# EAGLE schematic SIH26113_Maternity_Assist_Belt (EAGLE 9.6.2)

## Sheet 1 of 7: SHEET 1/7 - POWER ENTRY, CHARGING AND 3V3 REGULATION
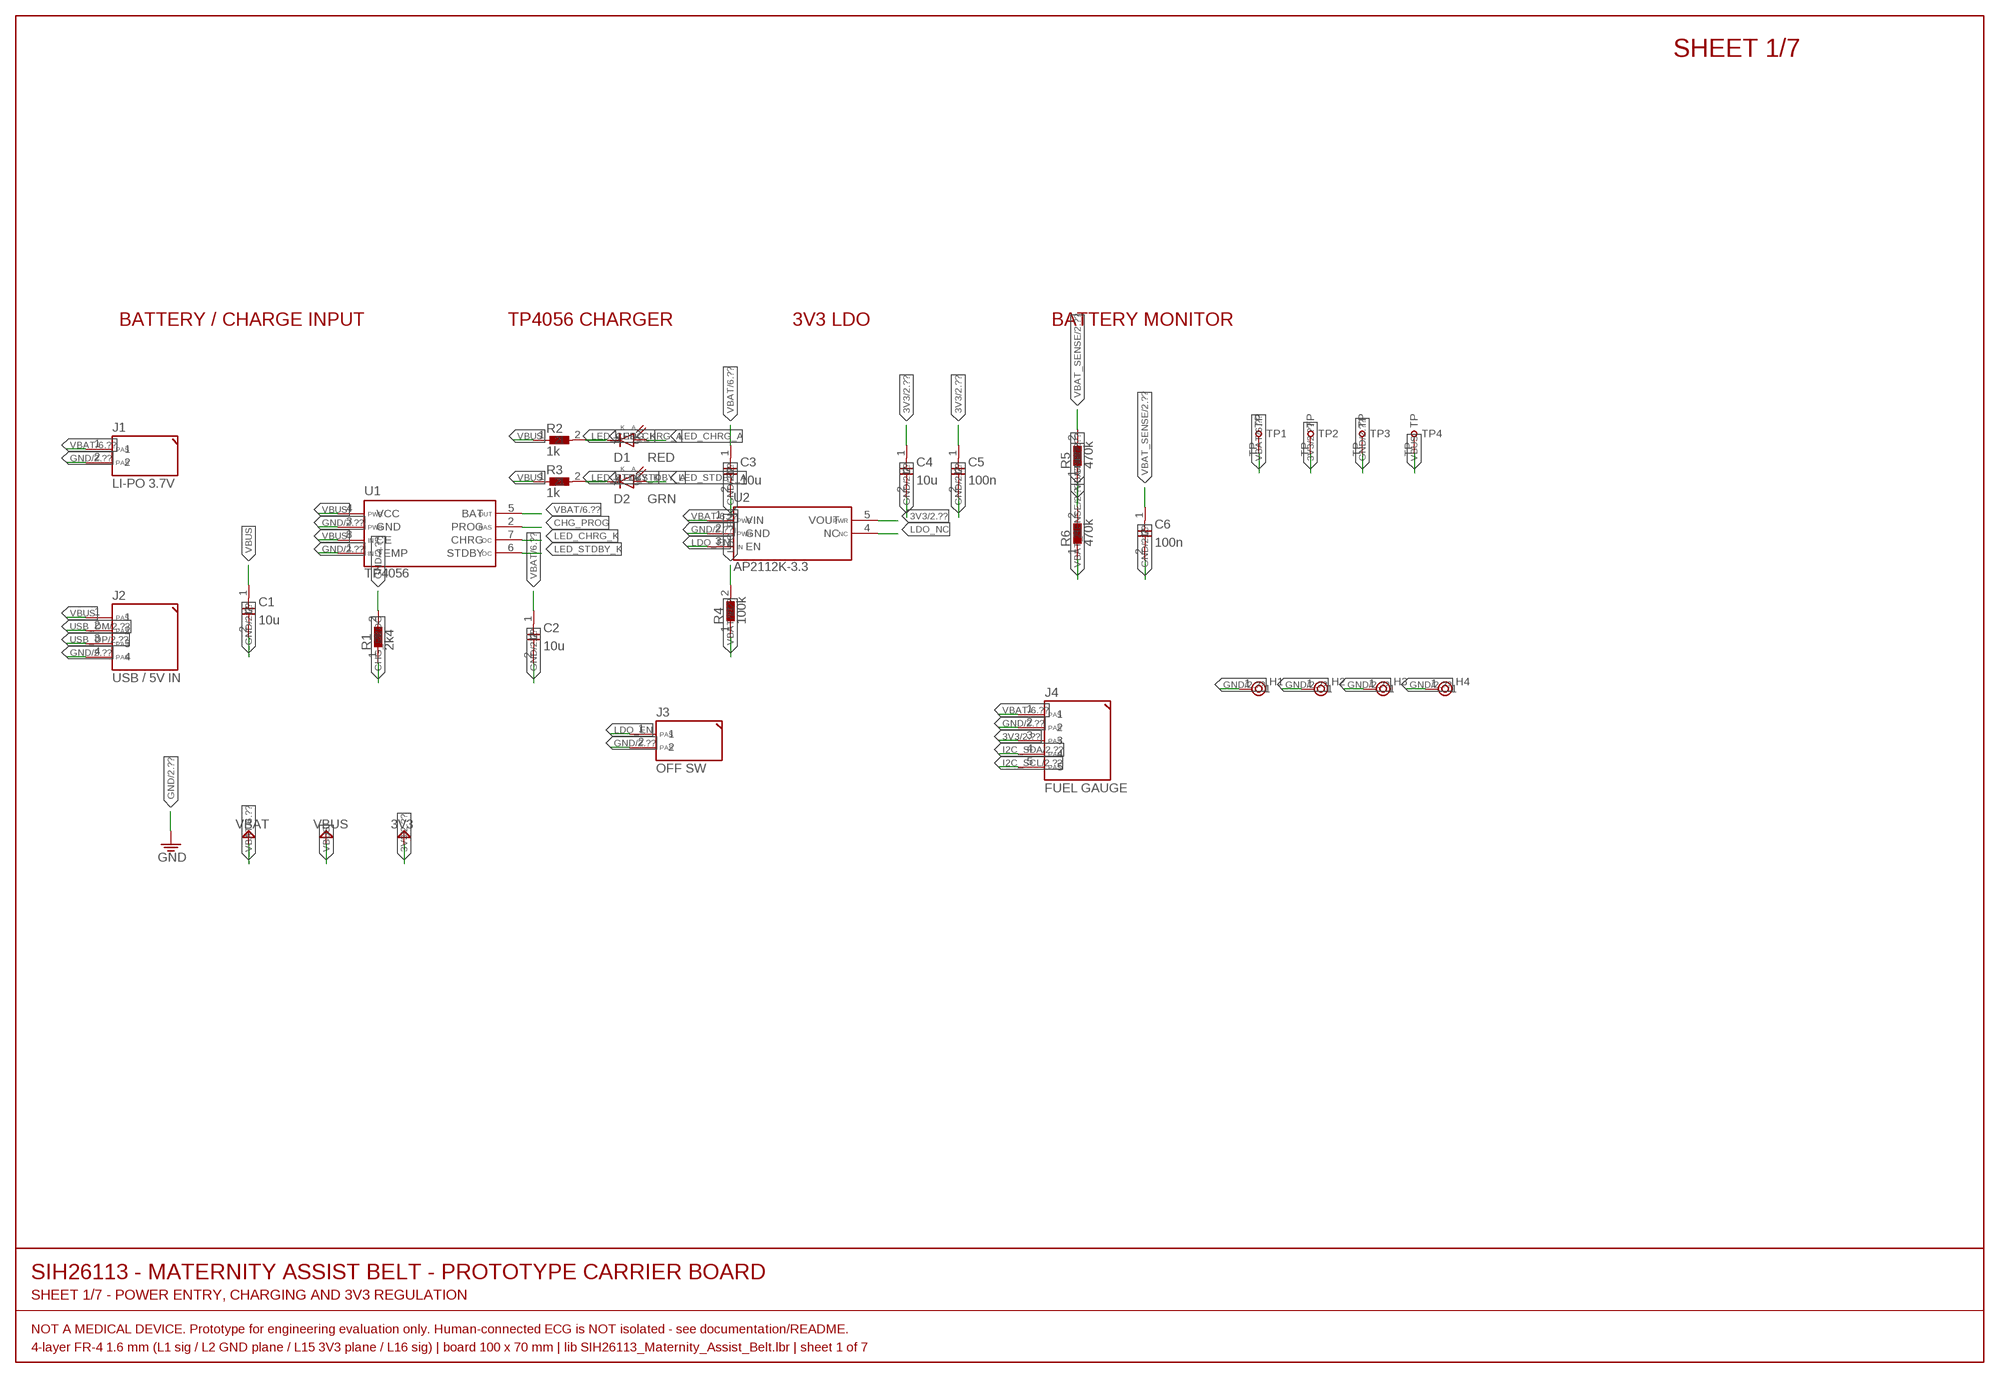
[diagram p0: schematic, sheet 1]

### Parts
C1  10u  C-0805  [C0805]
C2  10u  C-0805  [C0805]
C3  10u  C-0805  [C0805]
C4  10u  C-0805  [C0805]
C5  100n  C-0805  [C0805]
C6  100n  C-0805  [C0805]
D1  RED  LED-0805  [LED0805]
D2  GRN  LED-0805  [LED0805]
H1  M2  MOUNTHOLE-M2  [MOUNT-M2]
H2  M2  MOUNTHOLE-M2  [MOUNT-M2]
H3  M2  MOUNTHOLE-M2  [MOUNT-M2]
H4  M2  MOUNTHOLE-M2  [MOUNT-M2]
J1  LI-PO 3.7V  JST-PH-2  [JST-PH-2]
J2  USB / 5V IN  HDR-1X4  [HDR-1X4]
J3  OFF SW  HDR-1X2  [HDR-1X2]
J4  FUEL GAUGE  HDR-1X5  [HDR-1X5]
R1  2k4  R-0805  [R0805]
R2  1k  R-0805  [R0805]
R3  1k  R-0805  [R0805]
R4  100k  R-0805  [R0805]
R5  470k  R-0805  [R0805]
R6  470k  R-0805  [R0805]
TP1  VBAT  TESTPOINT  [TESTPOINT-1.5]
TP2  3V3  TESTPOINT  [TESTPOINT-1.5]
TP3  GND  TESTPOINT  [TESTPOINT-1.5]
TP4  VBUS  TESTPOINT  [TESTPOINT-1.5]
U1  TP4056  [SOIC-8-N]
U2  AP2112K-3.3  [SOT-23-5]

### Nets
3V3 [power]: C4.1 C5.1 J4.3 TP2.TP U2.5(VOUT) ; also sheet 2,3,4,5,6,7
CHG_PROG: R1.1 U1.2(PROG)
GND [power]: C1.2 C2.2 C3.2 C4.2 C5.2 C6.2 H1.1 H2.1 H3.1 H4.1 J1.2 J2.4 J3.2 J4.2 R1.2 R6.2 TP3.TP U1.1(TEMP) U1.3(GND) U2.2(GND) ; also sheet 2,3,4,5,6,7
I2C_SCL: J4.5 ; also sheet 2,3,7
I2C_SDA: J4.4 ; also sheet 2,3,7
LDO_EN: J3.1 R4.2 U2.3(EN)
LDO_NC: U2.4(NC)
LED_CHRG_A: D1.2(A) R2.2
LED_CHRG_K: D1.1(C) U1.7(CHRG)
LED_STDBY_A: D2.2(A) R3.2
LED_STDBY_K: D2.1(C) U1.6(STDBY)
USB_DM: J2.2 ; also sheet 2
USB_DP: J2.3 ; also sheet 2
VBAT [power]: C2.1 C3.1 J1.1 J4.1 R4.1 R5.1 TP1.TP U1.5(BAT) U2.1(VIN) ; also sheet 6
VBAT_SENSE: C6.1 R5.2 R6.1 ; also sheet 2
VBUS [power]: C1.1 J2.1 R2.1 R3.1 TP4.TP U1.4(VCC) U1.8(CE)

### Notes on the sheet
- SHEET 1/7
- BATTERY / CHARGE INPUT | TP4056 CHARGER | 3V3 LDO | BATTERY MONITOR
- SIH26113 - MATERNITY ASSIST BELT - PROTOTYPE CARRIER BOARD
- SHEET 1/7 - POWER ENTRY, CHARGING AND 3V3 REGULATION
- NOT A MEDICAL DEVICE. Prototype for engineering evaluation only. Human-connected ECG is NOT isolated - see documentation/README.
- 4-layer FR-4 1.6 mm (L1 sig / L2 GND plane / L15 3V3 plane / L16 sig) | board 100 x 70 mm | lib SIH26113_Maternity_Assist_Belt.lbr | sheet 1 of 7

## Sheet 2 of 7: SHEET 2/7 - ESP32-S3 CENTRAL MCU, RESET/BOOT, PROGRAMMING, INDICATORS
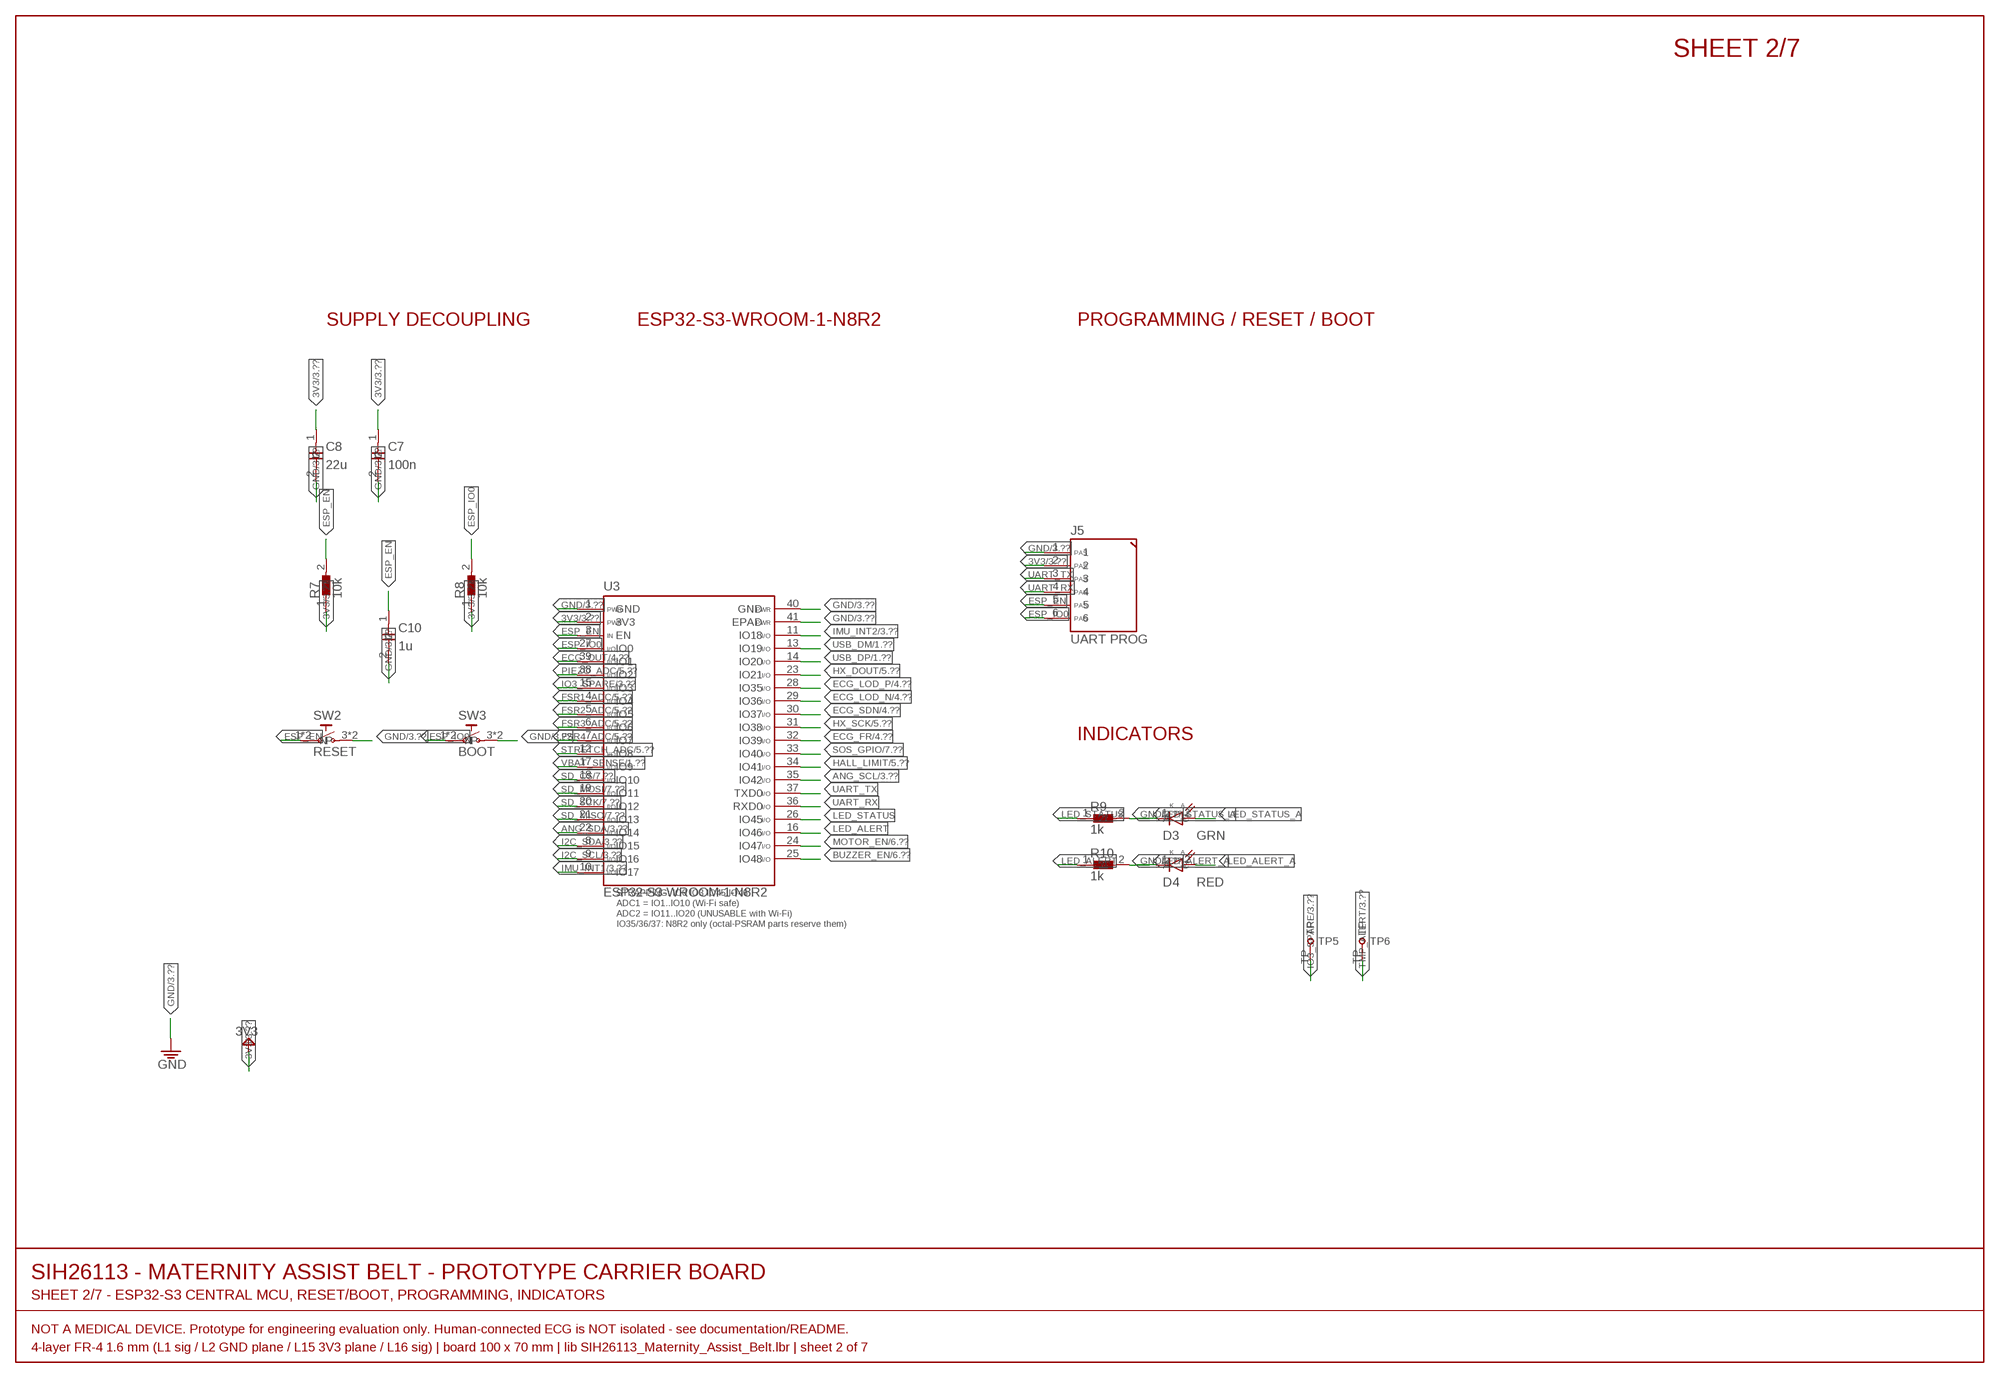
[diagram p1: schematic, sheet 2]

### Parts
C7  100n  C-0805  [C0805]
C8  22u  C-0805  [C0805]
C10  1u  C-0805  [C0805]
D3  GRN  LED-0805  [LED0805]
D4  RED  LED-0805  [LED0805]
J5  UART PROG  HDR-1X6  [HDR-1X6]
R7  10k  R-0805  [R0805]
R8  10k  R-0805  [R0805]
R9  1k  R-0805  [R0805]
R10  1k  R-0805  [R0805]
SW2  RESET  SW-TACT-6MM  [TACT-6X6-THT]
SW3  BOOT  SW-TACT-6MM  [TACT-6X6-THT]
TP5  IO3  TESTPOINT  [TESTPOINT-1.5]
TP6  TMP_ALERT  TESTPOINT  [TESTPOINT-1.5]
U3  ESP32-S3-WROOM-1-N8R2  ESP32-S3-WROOM-1  [ESP32-S3-WROOM-1]

### Nets
3V3 [power]: C7.1 C8.1 J5.2 R7.1 R8.1 U3.2(3V3) ; also sheet 1,3,4,5,6,7
ANG_SCL: U3.35(IO42) ; also sheet 3
ANG_SDA: U3.22(IO14) ; also sheet 3
BUZZER_EN: U3.25(IO48) ; also sheet 6
ECG_FR: U3.32(IO39) ; also sheet 4
ECG_LOD_N: U3.29(IO36) ; also sheet 4
ECG_LOD_P: U3.28(IO35) ; also sheet 4
ECG_OUT [analog_ecg]: U3.39(IO1) ; also sheet 4
ECG_SDN: U3.30(IO37) ; also sheet 4
ESP_EN: C10.1 J5.5 R7.2 SW2.1(P) SW2.2(P) U3.3(EN)
ESP_IO0: J5.6 R8.2 SW3.1(P) SW3.2(P) U3.27(IO0)
FSR1_ADC: U3.4(IO4) ; also sheet 5
FSR2_ADC: U3.5(IO5) ; also sheet 5
FSR3_ADC: U3.6(IO6) ; also sheet 5
FSR4_ADC: U3.7(IO7) ; also sheet 5
GND [power]: C7.2 C8.2 C10.2 D3.1(C) D4.1(C) J5.1 SW2.3(N) SW2.4(N) SW3.3(N) SW3.4(N) U3.1(GND) U3.40(GND) U3.41(EPAD) ; also sheet 1,3,4,5,6,7
HALL_LIMIT: U3.34(IO41) ; also sheet 5
HX_DOUT: U3.23(IO21) ; also sheet 5
HX_SCK: U3.31(IO38) ; also sheet 5
I2C_SCL: U3.9(IO16) ; also sheet 1,3,7
I2C_SDA: U3.8(IO15) ; also sheet 1,3,7
IMU_INT1: U3.10(IO17) ; also sheet 3
IMU_INT2: U3.11(IO18) ; also sheet 3
IO3_SPARE: TP5.TP U3.15(IO3) ; also sheet 3
LED_ALERT: R10.1 U3.16(IO46)
LED_ALERT_A: D4.2(A) R10.2
LED_STATUS: R9.1 U3.26(IO45)
LED_STATUS_A: D3.2(A) R9.2
MOTOR_EN: U3.24(IO47) ; also sheet 6
PIEZO_ADC: U3.38(IO2) ; also sheet 5
SD_CS: U3.18(IO10) ; also sheet 7
SD_MISO: U3.21(IO13) ; also sheet 7
SD_MOSI: U3.19(IO11) ; also sheet 7
SD_SCK: U3.20(IO12) ; also sheet 7
SOS_GPIO: U3.33(IO40) ; also sheet 7
STRETCH_ADC: U3.12(IO8) ; also sheet 5
TMP_ALERT: TP6.TP ; also sheet 3
UART_RX: J5.4 U3.36(RXD0)
UART_TX: J5.3 U3.37(TXD0)
USB_DM: U3.13(IO19) ; also sheet 1
USB_DP: U3.14(IO20) ; also sheet 1
VBAT_SENSE: U3.17(IO9) ; also sheet 1

### Notes on the sheet
- SHEET 2/7
- SUPPLY DECOUPLING | ESP32-S3-WROOM-1-N8R2 | PROGRAMMING / RESET / BOOT
- INDICATORS
- SIH26113 - MATERNITY ASSIST BELT - PROTOTYPE CARRIER BOARD
- SHEET 2/7 - ESP32-S3 CENTRAL MCU, RESET/BOOT, PROGRAMMING, INDICATORS
- NOT A MEDICAL DEVICE. Prototype for engineering evaluation only. Human-connected ECG is NOT isolated - see documentation/README.
- 4-layer FR-4 1.6 mm (L1 sig / L2 GND plane / L15 3V3 plane / L16 sig) | board 100 x 70 mm | lib SIH26113_Maternity_Assist_Belt.lbr | sheet 2 of 7

## Sheet 3 of 7: SHEET 3/7 - I2C SENSORS (TMP117, LSM6DSOX, AS5600) - TWO BUSSES
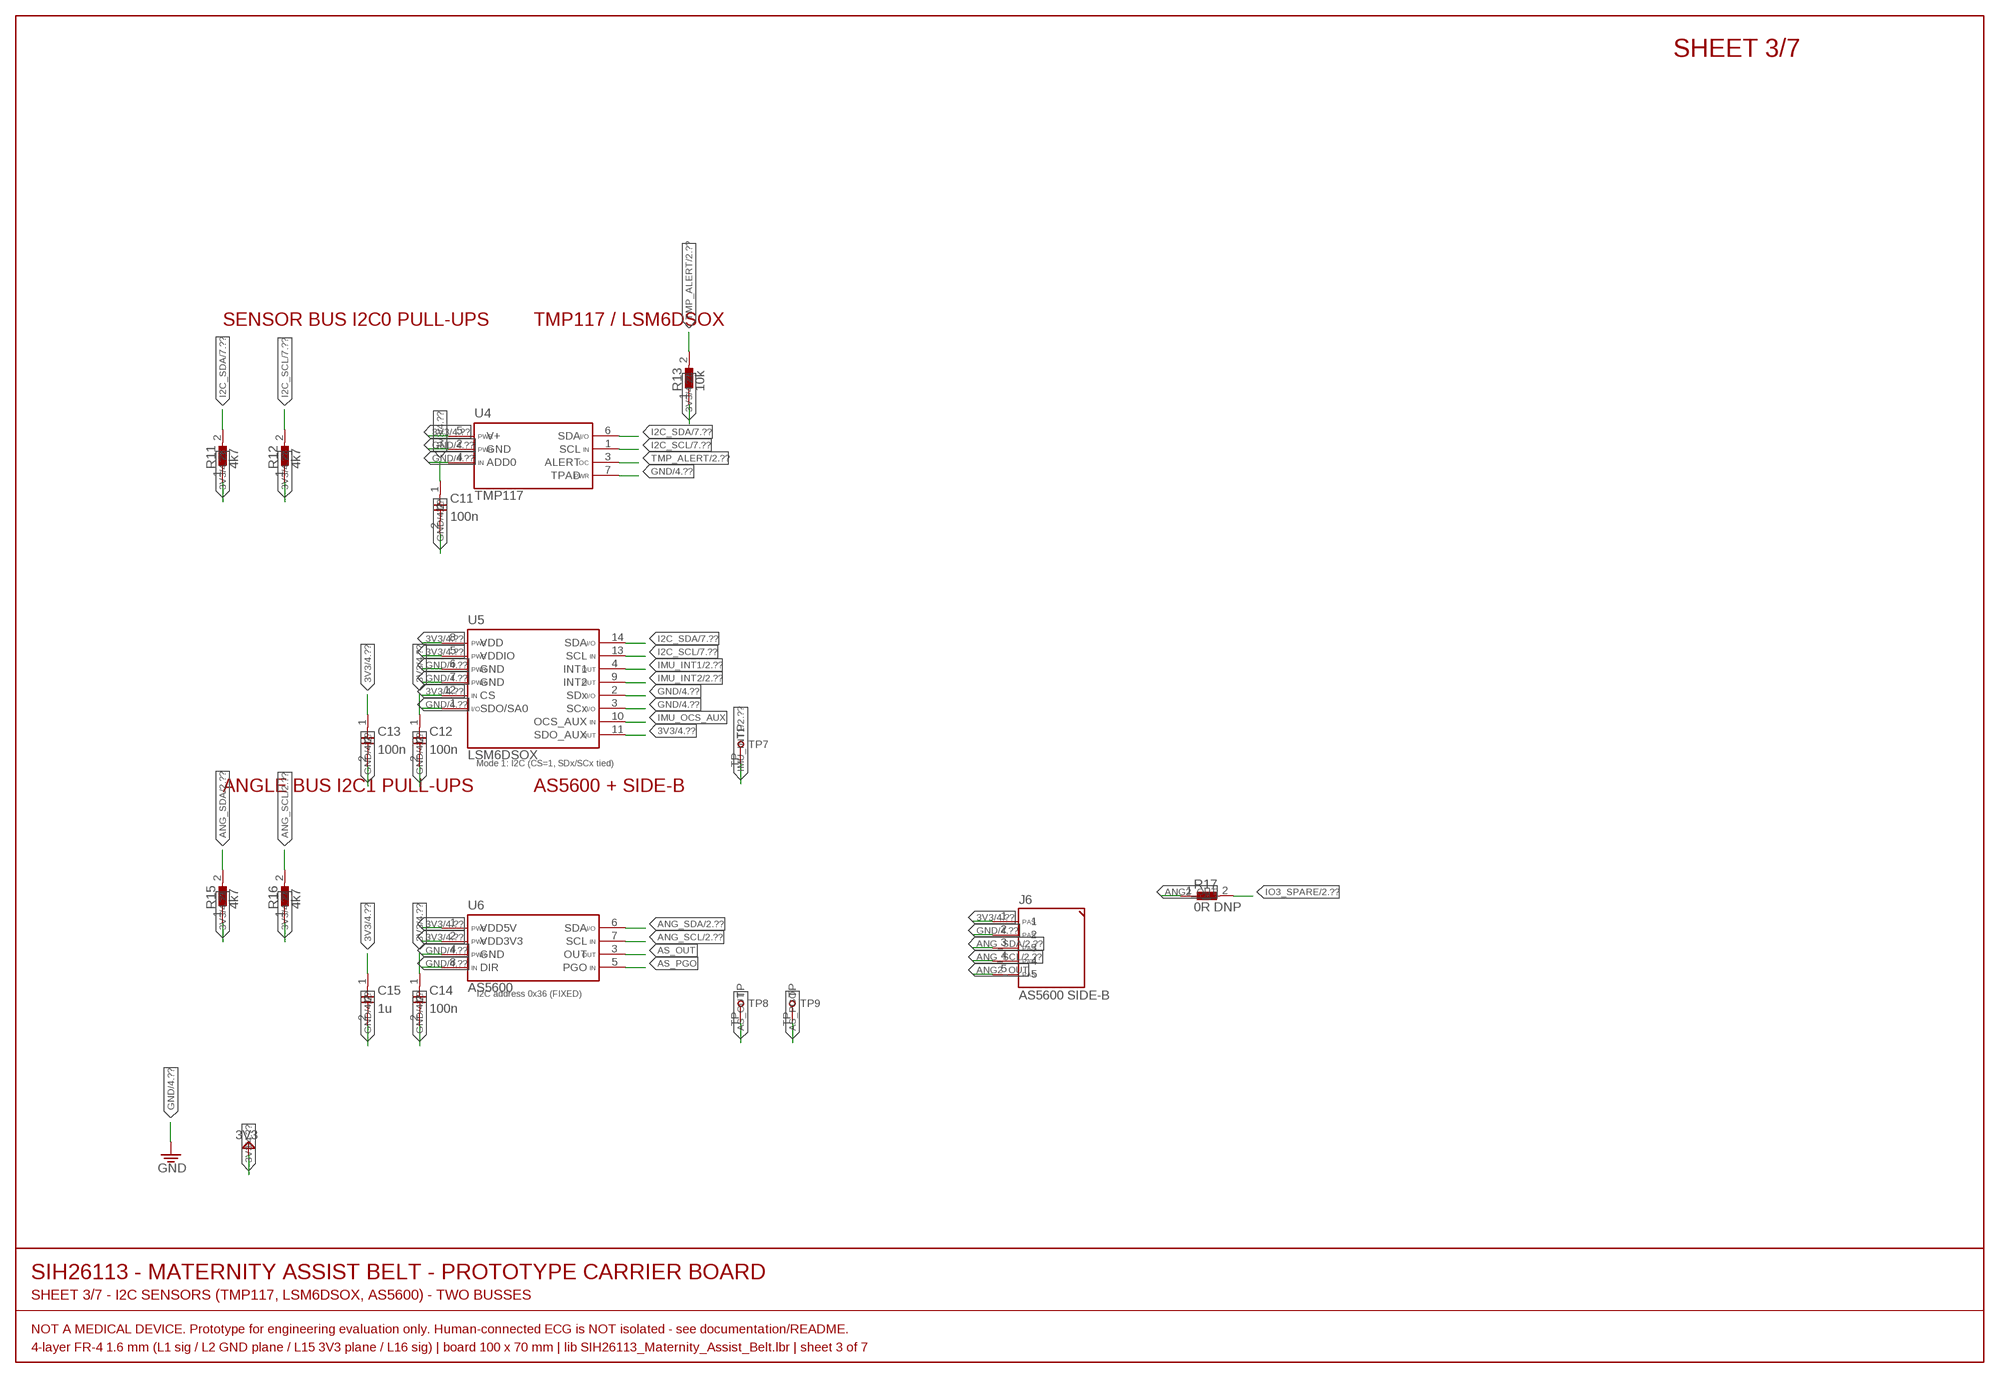
[diagram p2: schematic, sheet 3]

### Parts
C11  100n  C-0805  [C0805]
C12  100n  C-0805  [C0805]
C13  100n  C-0805  [C0805]
C14  100n  C-0805  [C0805]
C15  1u  C-0805  [C0805]
J6  AS5600 SIDE-B  HDR-1X5  [HDR-1X5]
R11  4k7  R-0805  [R0805]
R12  4k7  R-0805  [R0805]
R13  10k  R-0805  [R0805]
R15  4k7  R-0805  [R0805]
R16  4k7  R-0805  [R0805]
R17  0R DNP  R-0805  [R0805]
TP7  IMU_INT1  TESTPOINT  [TESTPOINT-1.5]
TP8  AS_OUT  TESTPOINT  [TESTPOINT-1.5]
TP9  AS_PGO  TESTPOINT  [TESTPOINT-1.5]
U4  TMP117  [WSON-6-DRV0006B]
U5  LSM6DSOX  [LGA-14L-2.5X3.0]
U6  AS5600  [SOIC-8-N]

### Nets
3V3 [power]: C11.1 C12.1 C13.1 C14.1 C15.1 J6.1 R11.1 R12.1 R13.1 R15.1 R16.1 U4.5(V+) U5.5(VDDIO) U5.8(VDD) U5.11(SDO_AUX) U5.12(CS) U6.1(VDD5V) U6.2(VDD3V3) ; also sheet 1,2,4,5,6,7
ANG2_OUT: J6.5 R17.1
ANG_SCL: J6.4 R16.2 U6.7(SCL) ; also sheet 2
ANG_SDA: J6.3 R15.2 U6.6(SDA) ; also sheet 2
AS_OUT: TP8.TP U6.3(OUT)
AS_PGO: TP9.TP U6.5(PGO)
GND [power]: C11.2 C12.2 C13.2 C14.2 C15.2 J6.2 U4.2(GND) U4.4(ADD0) U4.7(TPAD) U5.1(SDO/SA0) U5.2(SDx) U5.3(SCx) U5.6(GND) U5.7(GND) U6.4(GND) U6.8(DIR) ; also sheet 1,2,4,5,6,7
I2C_SCL: R12.2 U4.1(SCL) U5.13(SCL) ; also sheet 1,2,7
I2C_SDA: R11.2 U4.6(SDA) U5.14(SDA) ; also sheet 1,2,7
IMU_INT1: TP7.TP U5.4(INT1) ; also sheet 2
IMU_INT2: U5.9(INT2) ; also sheet 2
IMU_OCS_AUX: U5.10(OCS_AUX)
IO3_SPARE: R17.2 ; also sheet 2
TMP_ALERT: R13.2 U4.3(ALERT) ; also sheet 2

### Notes on the sheet
- SHEET 3/7
- SENSOR BUS I2C0 PULL-UPS | TMP117 / LSM6DSOX
- ANGLE BUS I2C1 PULL-UPS | AS5600 + SIDE-B
- SIH26113 - MATERNITY ASSIST BELT - PROTOTYPE CARRIER BOARD
- SHEET 3/7 - I2C SENSORS (TMP117, LSM6DSOX, AS5600) - TWO BUSSES
- NOT A MEDICAL DEVICE. Prototype for engineering evaluation only. Human-connected ECG is NOT isolated - see documentation/README.
- 4-layer FR-4 1.6 mm (L1 sig / L2 GND plane / L15 3V3 plane / L16 sig) | board 100 x 70 mm | lib SIH26113_Maternity_Assist_Belt.lbr | sheet 3 of 7

## Sheet 4 of 7: SHEET 4/7 - ECG ANALOG FRONT END (AD8232)
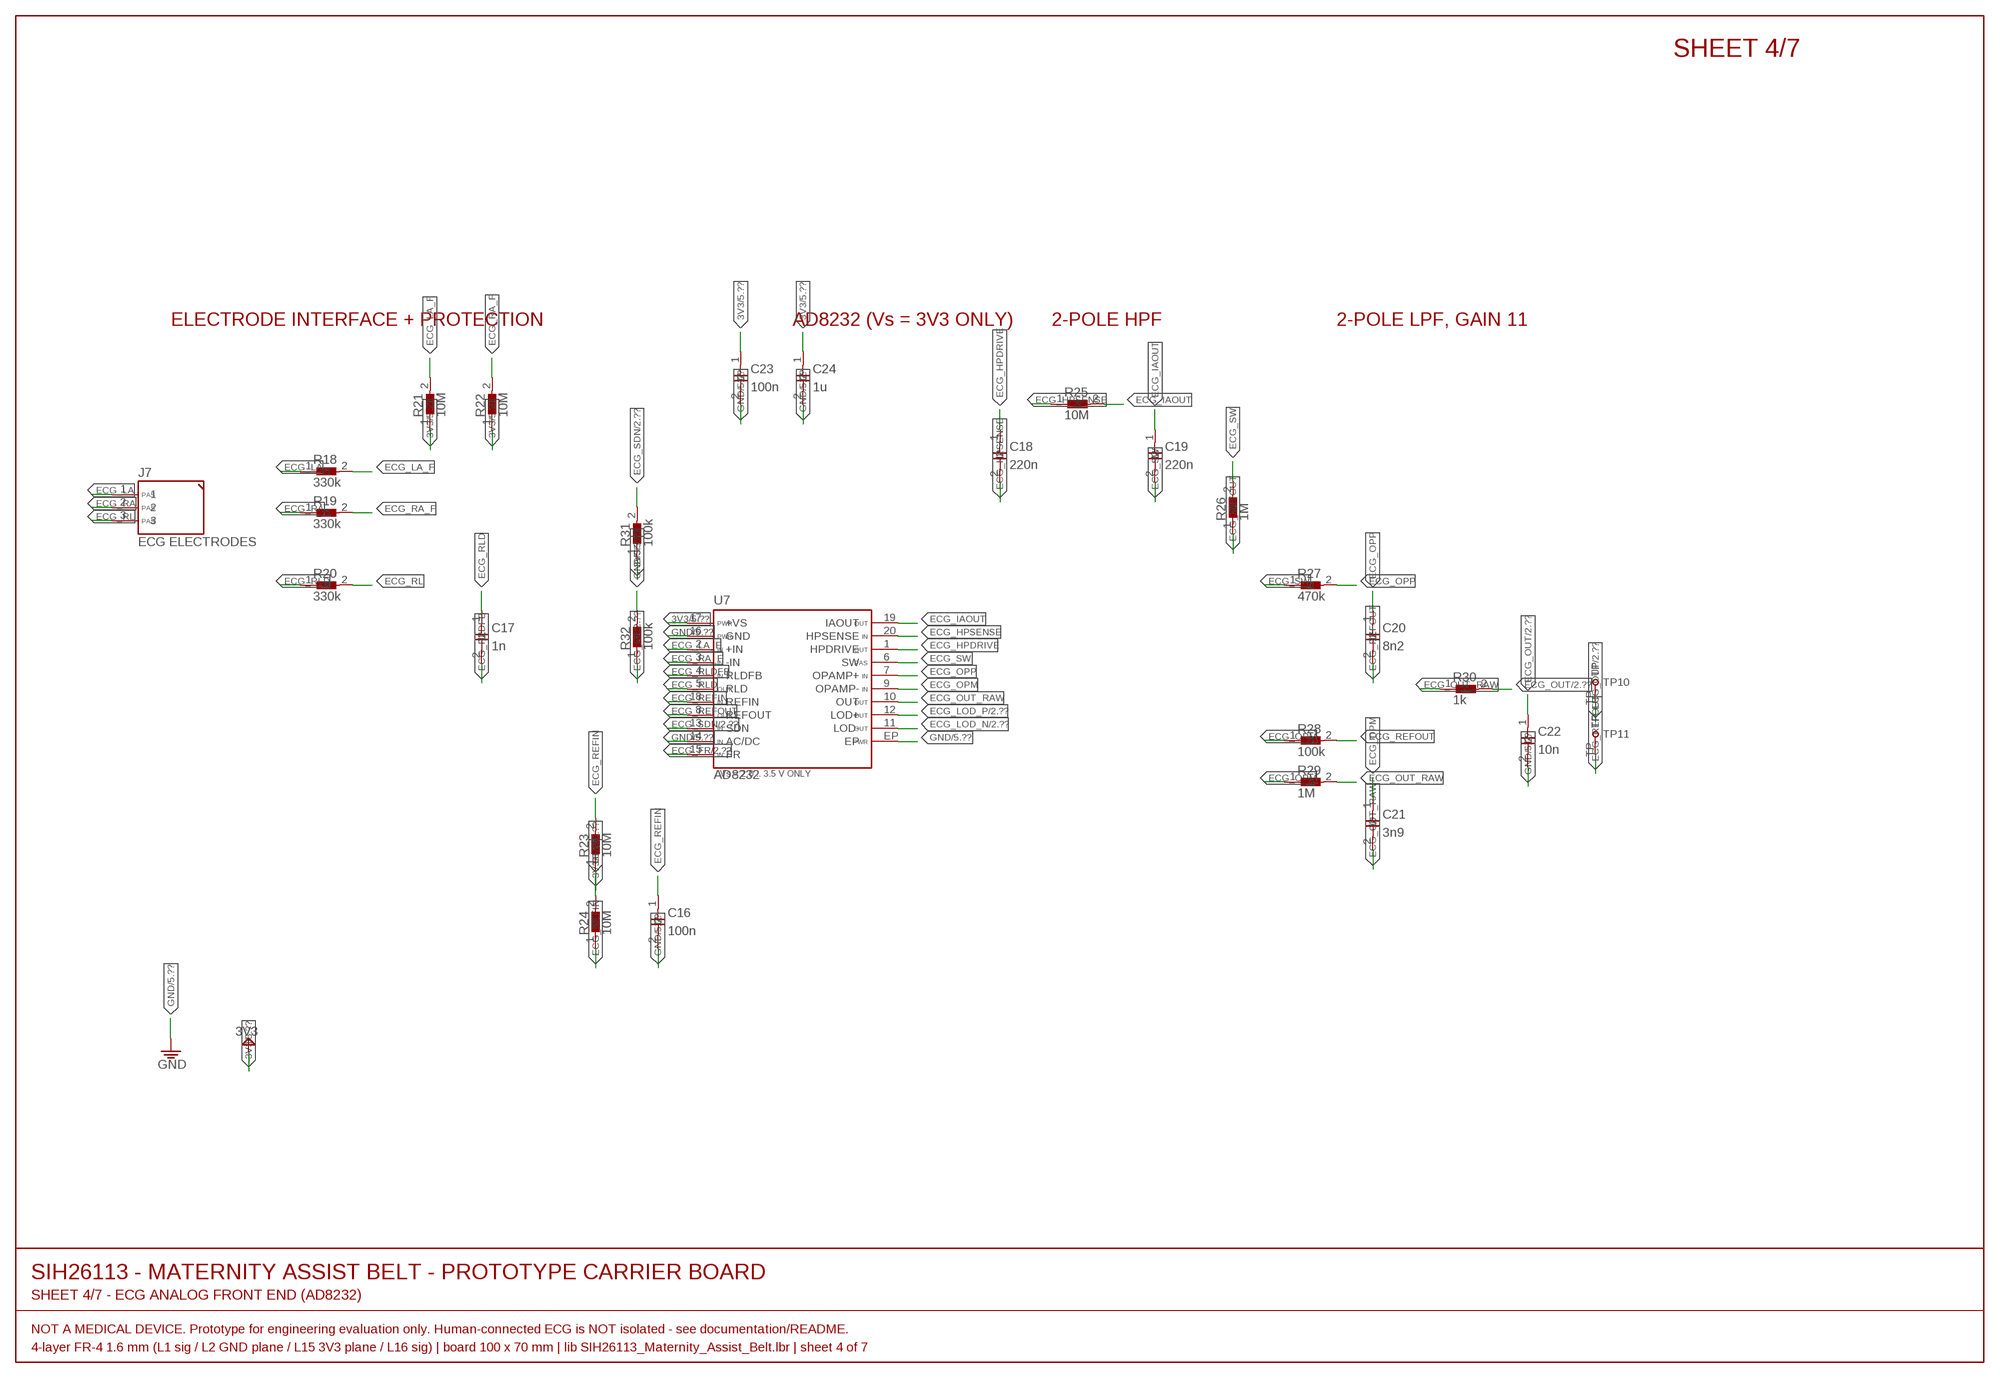
[diagram p3: schematic, sheet 4]

### Parts
C16  100n  C-0805  [C0805]
C17  1n  C-0805  [C0805]
C18  220n  C-0805  [C0805]
C19  220n  C-0805  [C0805]
C20  8n2  C-0805  [C0805]
C21  3n9  C-0805  [C0805]
C22  10n  C-0805  [C0805]
C23  100n  C-0805  [C0805]
C24  1u  C-0805  [C0805]
J7  ECG ELECTRODES  HDR-1X3  [HDR-1X3]
R18  330k  R-0805  [R0805]
R19  330k  R-0805  [R0805]
R20  330k  R-0805  [R0805]
R21  10M  R-0805  [R0805]
R22  10M  R-0805  [R0805]
R23  10M  R-0805  [R0805]
R24  10M  R-0805  [R0805]
R25  10M  R-0805  [R0805]
R26  1M  R-0805  [R0805]
R27  470k  R-0805  [R0805]
R28  100k  R-0805  [R0805]
R29  1M  R-0805  [R0805]
R30  1k  R-0805  [R0805]
R31  100k  R-0805  [R0805]
R32  100k  R-0805  [R0805]
TP10  ECG_OUT  TESTPOINT  [TESTPOINT-1.5]
TP11  ECG_REF  TESTPOINT  [TESTPOINT-1.5]
U7  AD8232  [LFCSP-20-4X4-P050]

### Nets
3V3 [power]: C23.1 C24.1 R21.1 R22.1 R23.1 R31.1 U7.17(+VS) ; also sheet 1,2,3,5,6,7
ECG_FR: R32.1 U7.15(FR) ; also sheet 2
ECG_HPDRIVE: C18.1 U7.1(HPDRIVE)
ECG_HPSENSE [analog_ecg]: C18.2 R25.1 U7.20(HPSENSE)
ECG_IAOUT [analog_ecg]: C19.1 R25.2 U7.19(IAOUT)
ECG_LA [analog_ecg]: J7.1 R18.1
ECG_LA_F [analog_ecg]: R18.2 R21.2 U7.2(+IN)
ECG_LOD_N: U7.11(LOD-) ; also sheet 2
ECG_LOD_P: U7.12(LOD+) ; also sheet 2
ECG_OPM [analog_ecg]: C21.1 R28.1 R29.1 U7.9(OPAMP-)
ECG_OPP [analog_ecg]: C20.1 R27.2 U7.7(OPAMP+)
ECG_OUT [analog_ecg]: C22.1 R30.2 TP10.TP ; also sheet 2
ECG_OUT_RAW [analog_ecg]: C21.2 R29.2 R30.1 U7.10(OUT)
ECG_RA [analog_ecg]: J7.2 R19.1
ECG_RA_F [analog_ecg]: R19.2 R22.2 U7.3(-IN)
ECG_REFIN [analog_ecg]: C16.1 R23.2 R24.1 U7.18(REFIN)
ECG_REFOUT [analog_ecg]: C20.2 R26.1 R28.2 TP11.TP U7.8(REFOUT)
ECG_RL [analog_ecg]: J7.3 R20.2
ECG_RLD [analog_ecg]: C17.1 R20.1 U7.5(RLD)
ECG_RLDFB: C17.2 U7.4(RLDFB)
ECG_SDN: R31.2 U7.13(SDN) ; also sheet 2
ECG_SW [analog_ecg]: C19.2 R26.2 R27.1 U7.6(SW)
GND [power]: C16.2 C22.2 C23.2 C24.2 R24.2 R32.2 U7.14(AC/DC) U7.16(GND) U7.EP ; also sheet 1,2,3,5,6,7

### Notes on the sheet
- SHEET 4/7
- ELECTRODE INTERFACE + PROTECTION | AD8232 (Vs = 3V3 ONLY) | 2-POLE HPF | 2-POLE LPF, GAIN 11
- SIH26113 - MATERNITY ASSIST BELT - PROTOTYPE CARRIER BOARD
- SHEET 4/7 - ECG ANALOG FRONT END (AD8232)
- NOT A MEDICAL DEVICE. Prototype for engineering evaluation only. Human-connected ECG is NOT isolated - see documentation/README.
- 4-layer FR-4 1.6 mm (L1 sig / L2 GND plane / L15 3V3 plane / L16 sig) | board 100 x 70 mm | lib SIH26113_Maternity_Assist_Belt.lbr | sheet 4 of 7

## Sheet 5 of 7: SHEET 5/7 - MECHANICAL SENSING (LOAD CELL, FSR, STRETCH, PIEZO, HALL)
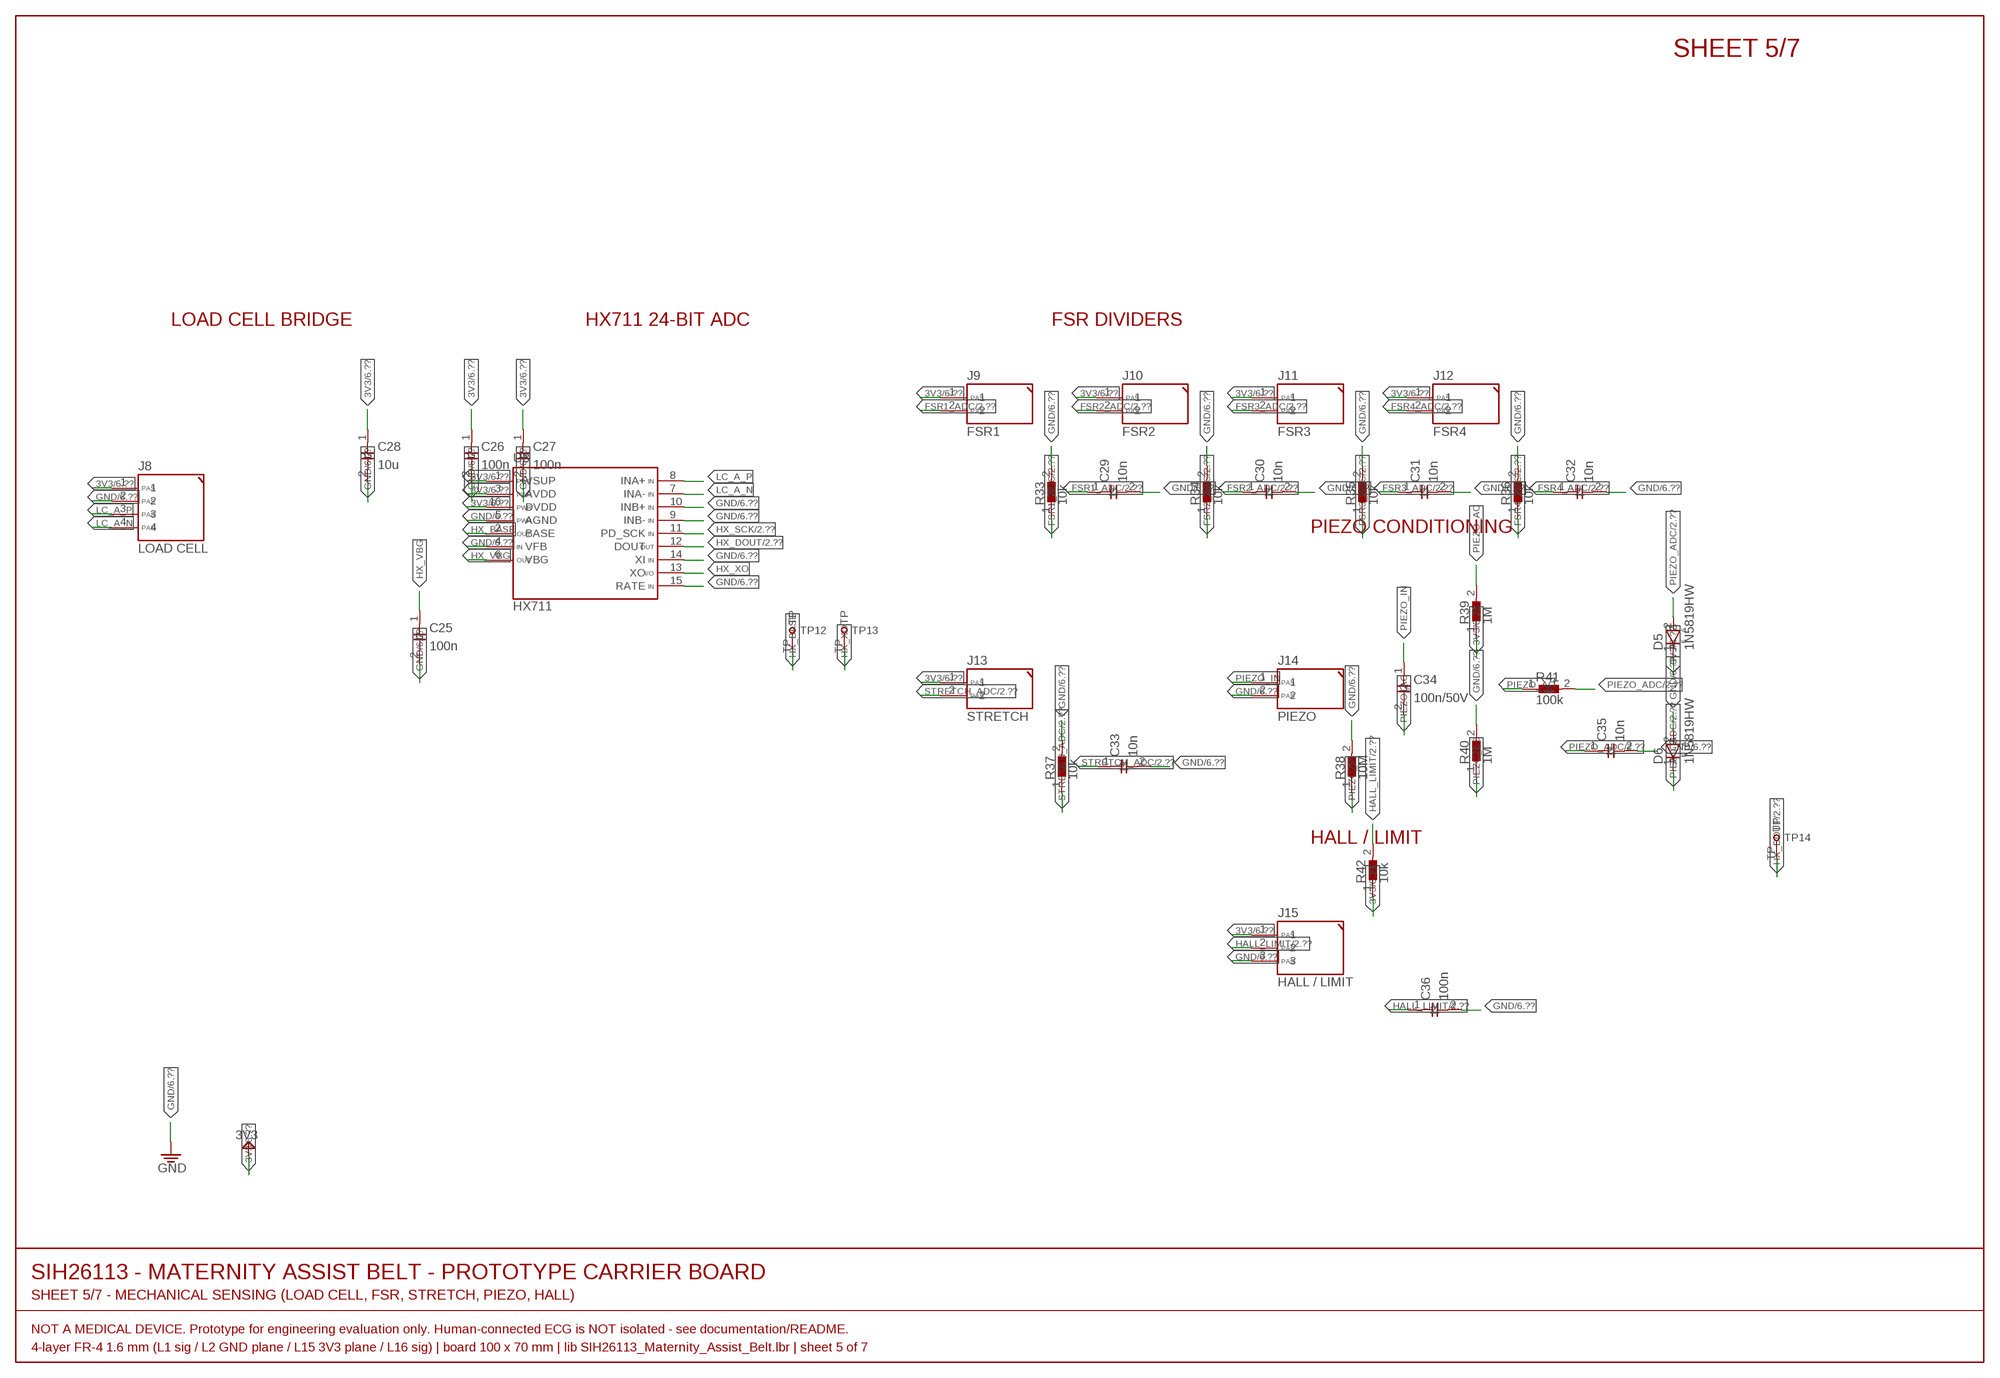
[diagram p4: schematic, sheet 5]

### Parts
C25  100n  C-0805  [C0805]
C26  100n  C-0805  [C0805]
C27  100n  C-0805  [C0805]
C28  10u  C-0805  [C0805]
C29  10n  C-0805  [C0805]
C30  10n  C-0805  [C0805]
C31  10n  C-0805  [C0805]
C32  10n  C-0805  [C0805]
C33  10n  C-0805  [C0805]
C34  100n/50V  C-0805  [C0805]
C35  10n  C-0805  [C0805]
C36  100n  C-0805  [C0805]
D5  1N5819HW  DIODE-SOD123  [SOD-123]
D6  1N5819HW  DIODE-SOD123  [SOD-123]
J8  LOAD CELL  JST-PH-4  [JST-PH-4]
J9  FSR1  HDR-1X2  [HDR-1X2]
J10  FSR2  HDR-1X2  [HDR-1X2]
J11  FSR3  HDR-1X2  [HDR-1X2]
J12  FSR4  HDR-1X2  [HDR-1X2]
J13  STRETCH  HDR-1X2  [HDR-1X2]
J14  PIEZO  HDR-1X2  [HDR-1X2]
J15  HALL / LIMIT  HDR-1X3  [HDR-1X3]
R33  10k  R-0805  [R0805]
R34  10k  R-0805  [R0805]
R35  10k  R-0805  [R0805]
R36  10k  R-0805  [R0805]
R37  10k  R-0805  [R0805]
R38  10M  R-0805  [R0805]
R39  1M  R-0805  [R0805]
R40  1M  R-0805  [R0805]
R41  100k  R-0805  [R0805]
R42  10k  R-0805  [R0805]
TP12  HX_BASE  TESTPOINT  [TESTPOINT-1.5]
TP13  HX_XO  TESTPOINT  [TESTPOINT-1.5]
TP14  HX_DOUT  TESTPOINT  [TESTPOINT-1.5]
U8  HX711  [SOP-16-N]

### Nets
3V3 [power]: C26.1 C27.1 C28.1 D5.1(C) J8.1 J9.1 J10.1 J11.1 J12.1 J13.1 J15.1 R39.1 R42.1 U8.1(VSUP) U8.3(AVDD) U8.16(DVDD) ; also sheet 1,2,3,4,6,7
FSR1_ADC: C29.1 J9.2 R33.1 ; also sheet 2
FSR2_ADC: C30.1 J10.2 R34.1 ; also sheet 2
FSR3_ADC: C31.1 J11.2 R35.1 ; also sheet 2
FSR4_ADC: C32.1 J12.2 R36.1 ; also sheet 2
GND [power]: C25.2 C26.2 C27.2 C28.2 C29.2 C30.2 C31.2 C32.2 C33.2 C35.2 C36.2 D6.2(A) J8.2 J14.2 J15.3 R33.2 R34.2 R35.2 R36.2 R37.2 R38.2 R40.2 U8.4(VFB) U8.5(AGND) U8.9(INB-) U8.10(INB+) U8.14(XI) U8.15(RATE) ; also sheet 1,2,3,4,6,7
HALL_LIMIT: C36.1 J15.2 R42.2 ; also sheet 2
HX_BASE: TP12.TP U8.2(BASE)
HX_DOUT: TP14.TP U8.12(DOUT) ; also sheet 2
HX_SCK: U8.11(PD_SCK) ; also sheet 2
HX_VBG: C25.1 U8.6(VBG)
HX_XO: TP13.TP U8.13(XO)
LC_A_N: J8.4 U8.7(INA-)
LC_A_P: J8.3 U8.8(INA+)
PIEZO_AC: C34.2 R39.2 R40.1 R41.1
PIEZO_ADC: C35.1 D5.2(A) D6.1(C) R41.2 ; also sheet 2
PIEZO_IN: C34.1 J14.1 R38.1
STRETCH_ADC: C33.1 J13.2 R37.1 ; also sheet 2

### Notes on the sheet
- SHEET 5/7
- LOAD CELL BRIDGE | HX711 24-BIT ADC | FSR DIVIDERS
- PIEZO CONDITIONING
- HALL / LIMIT
- SIH26113 - MATERNITY ASSIST BELT - PROTOTYPE CARRIER BOARD
- SHEET 5/7 - MECHANICAL SENSING (LOAD CELL, FSR, STRETCH, PIEZO, HALL)
- NOT A MEDICAL DEVICE. Prototype for engineering evaluation only. Human-connected ECG is NOT isolated - see documentation/README.
- 4-layer FR-4 1.6 mm (L1 sig / L2 GND plane / L15 3V3 plane / L16 sig) | board 100 x 70 mm | lib SIH26113_Maternity_Assist_Belt.lbr | sheet 5 of 7

## Sheet 6 of 7: SHEET 6/7 - FET-DRIVEN ALERTS (VIBRATION MOTOR, BUZZER)
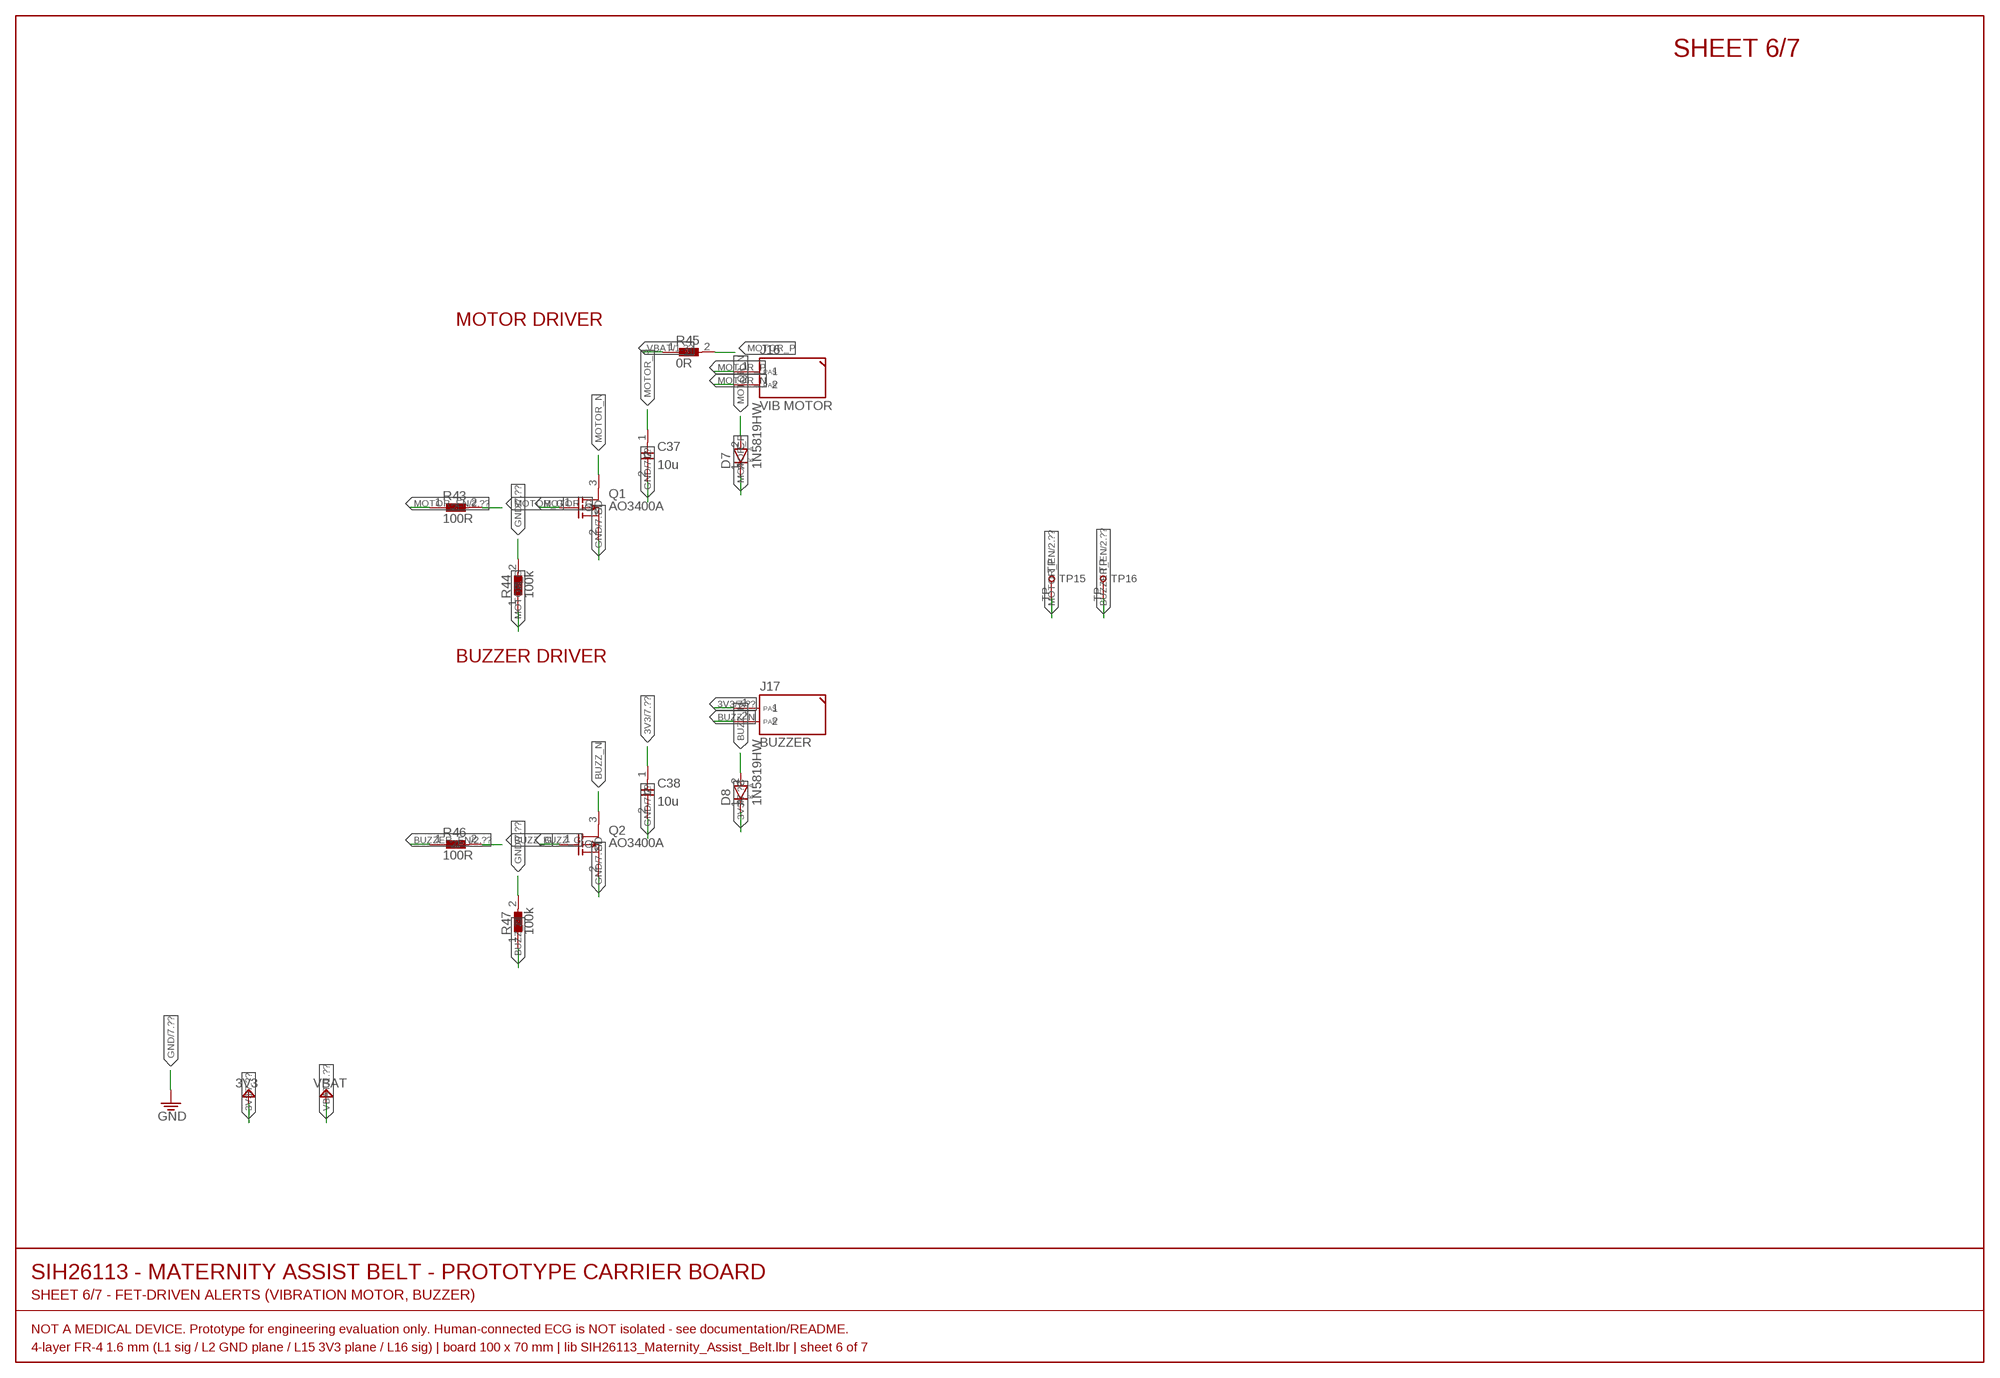
[diagram p5: schematic, sheet 6]

### Parts
C37  10u  C-0805  [C0805]
C38  10u  C-0805  [C0805]
D7  1N5819HW  DIODE-SOD123  [SOD-123]
D8  1N5819HW  DIODE-SOD123  [SOD-123]
J16  VIB MOTOR  HDR-1X2  [HDR-1X2]
J17  BUZZER  HDR-1X2  [HDR-1X2]
Q1  AO3400A  NMOS-SOT23  [SOT-23-3]
Q2  AO3400A  NMOS-SOT23  [SOT-23-3]
R43  100R  R-0805  [R0805]
R44  100k  R-0805  [R0805]
R45  0R  R-0805  [R0805]
R46  100R  R-0805  [R0805]
R47  100k  R-0805  [R0805]
TP15  MOTOR_EN  TESTPOINT  [TESTPOINT-1.5]
TP16  BUZZER_EN  TESTPOINT  [TESTPOINT-1.5]

### Nets
3V3 [power]: C38.1 D8.1(C) J17.1 ; also sheet 1,2,3,4,5,7
BUZZ_G: Q2.1(G) R46.2 R47.1
BUZZ_N: D8.2(A) J17.2 Q2.3(D)
BUZZER_EN: R46.1 TP16.TP ; also sheet 2
GND [power]: C37.2 C38.2 Q1.2(S) Q2.2(S) R44.2 R47.2 ; also sheet 1,2,3,4,5,7
MOTOR_EN: R43.1 TP15.TP ; also sheet 2
MOTOR_G: Q1.1(G) R43.2 R44.1
MOTOR_N [motor]: D7.2(A) J16.2 Q1.3(D)
MOTOR_P [motor]: C37.1 D7.1(C) J16.1 R45.2
VBAT [power]: R45.1 ; also sheet 1

### Notes on the sheet
- SHEET 6/7
- MOTOR DRIVER
- BUZZER DRIVER
- SIH26113 - MATERNITY ASSIST BELT - PROTOTYPE CARRIER BOARD
- SHEET 6/7 - FET-DRIVEN ALERTS (VIBRATION MOTOR, BUZZER)
- NOT A MEDICAL DEVICE. Prototype for engineering evaluation only. Human-connected ECG is NOT isolated - see documentation/README.
- 4-layer FR-4 1.6 mm (L1 sig / L2 GND plane / L15 3V3 plane / L16 sig) | board 100 x 70 mm | lib SIH26113_Maternity_Assist_Belt.lbr | sheet 6 of 7

## Sheet 7 of 7: SHEET 7/7 - USER INPUT AND STORAGE (SOS, microSD)
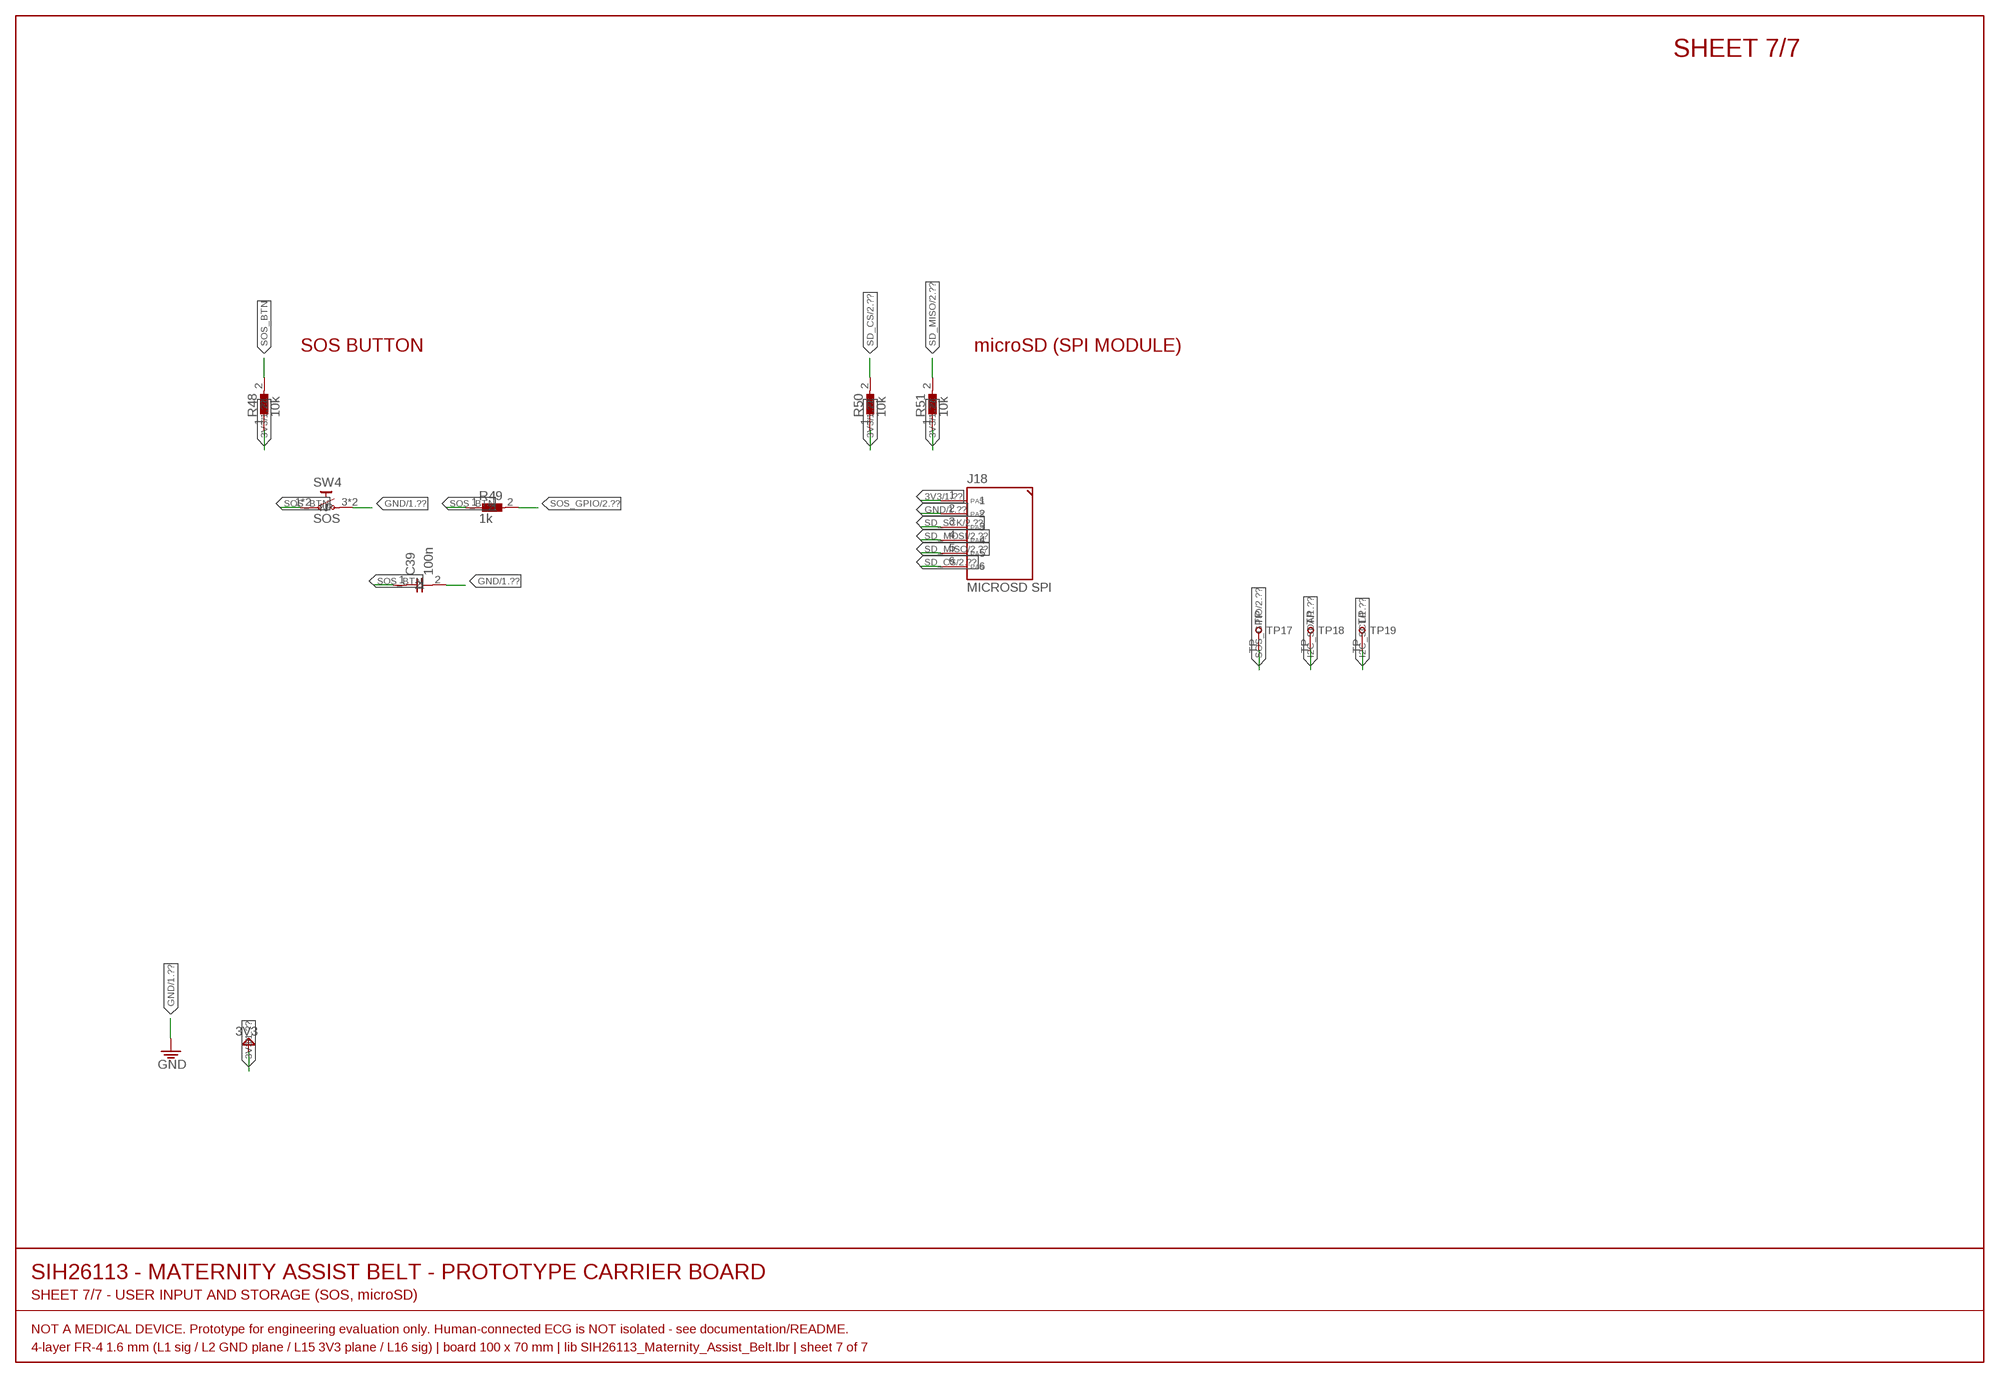
[diagram p6: schematic, sheet 7]

### Parts
C39  100n  C-0805  [C0805]
J18  MICROSD SPI  HDR-1X6  [HDR-1X6]
R48  10k  R-0805  [R0805]
R49  1k  R-0805  [R0805]
R50  10k  R-0805  [R0805]
R51  10k  R-0805  [R0805]
SW4  SOS  SW-TACT-6MM  [TACT-6X6-THT]
TP17  SOS_GPIO  TESTPOINT  [TESTPOINT-1.5]
TP18  I2C_SDA  TESTPOINT  [TESTPOINT-1.5]
TP19  I2C_SCL  TESTPOINT  [TESTPOINT-1.5]

### Nets
3V3 [power]: J18.1 R48.1 R50.1 R51.1 ; also sheet 1,2,3,4,5,6
GND [power]: C39.2 J18.2 SW4.3(N) SW4.4(N) ; also sheet 1,2,3,4,5,6
I2C_SCL: TP19.TP ; also sheet 1,2,3
I2C_SDA: TP18.TP ; also sheet 1,2,3
SD_CS: J18.6 R50.2 ; also sheet 2
SD_MISO: J18.5 R51.2 ; also sheet 2
SD_MOSI: J18.4 ; also sheet 2
SD_SCK: J18.3 ; also sheet 2
SOS_BTN: C39.1 R48.2 R49.1 SW4.1(P) SW4.2(P)
SOS_GPIO: R49.2 TP17.TP ; also sheet 2

### Notes on the sheet
- SHEET 7/7
- SOS BUTTON | microSD (SPI MODULE)
- SIH26113 - MATERNITY ASSIST BELT - PROTOTYPE CARRIER BOARD
- SHEET 7/7 - USER INPUT AND STORAGE (SOS, microSD)
- NOT A MEDICAL DEVICE. Prototype for engineering evaluation only. Human-connected ECG is NOT isolated - see documentation/README.
- 4-layer FR-4 1.6 mm (L1 sig / L2 GND plane / L15 3V3 plane / L16 sig) | board 100 x 70 mm | lib SIH26113_Maternity_Assist_Belt.lbr | sheet 7 of 7

## Library data of the parts
C1-C8 C10-C39 = SIH26113_Maternity_Assist_Belt:C-0805: Chip capacitor, 0805 (2012 metric)
D1-D4 = SIH26113_Maternity_Assist_Belt:LED-0805: Chip LED, 0805. Pad 1 = cathode.
D5-D8 = SIH26113_Maternity_Assist_Belt:DIODE-SOD123: Schottky/rectifier diode, SOD-123. Pad 1 = cathode (band).
H1-H4 = SIH26113_Maternity_Assist_Belt:MOUNTHOLE-M2: M2 plated mounting hole, GND-stitched
J1 = SIH26113_Maternity_Assist_Belt:JST-PH-2: JST PH 2.00 mm 2-circuit top-entry header (S2B-PH-K-S). Li-Po battery input.
J2 = SIH26113_Maternity_Assist_Belt:HDR-1X4: 1x4 2.54 mm pin header
J3 J9-J14 J16 J17 = SIH26113_Maternity_Assist_Belt:HDR-1X2: 1x2 2.54 mm pin header
J4 J6 = SIH26113_Maternity_Assist_Belt:HDR-1X5: 1x5 2.54 mm pin header
J5 J18 = SIH26113_Maternity_Assist_Belt:HDR-1X6: 1x6 2.54 mm pin header
J7 J15 = SIH26113_Maternity_Assist_Belt:HDR-1X3: 1x3 2.54 mm pin header
J8 = SIH26113_Maternity_Assist_Belt:JST-PH-4: JST PH 2.00 mm 4-circuit top-entry header (S4B-PH-K-S). Load-cell bridge input.
Q1 Q2 = SIH26113_Maternity_Assist_Belt:NMOS-SOT23: N-channel logic-level MOSFET, SOT-23-3. Standard assignment 1 = Gate, 2 = Source, 3 = Drain.
R1-R13 R15-R51 = SIH26113_Maternity_Assist_Belt:R-0805: Chip resistor, 0805 (2012 metric)
SW2-SW4 = SIH26113_Maternity_Assist_Belt:SW-TACT-6MM: 6 x 6 mm through-hole tactile push-button. Leads 1-2 and 3-4 are internally common, so each symbol pin maps to two pads (EAGLE multi-pad connect).
TP1-TP19 = SIH26113_Maternity_Assist_Belt:TESTPOINT: 1.5 mm SMD test point
U1 = SIH26113_Maternity_Assist_Belt:TP4056: NanJing Top Power TP4056-42-SOP8-PP 1 A standalone linear Li-ion charger, 4.2 V float. Pin map from the TP4056 datasheet pin description (page 2).
U2 = SIH26113_Maternity_Assist_Belt:AP2112K-3.3: Diodes AP2112K-3.3TRG1 600 mA CMOS LDO, fixed 3.3 V, with enable. Pin map from AP2112 DS39724 Rev.2-2 pin descriptions (SOT25 column).
U3 = SIH26113_Maternity_Assist_Belt:ESP32-S3-WROOM-1: Espressif ESP32-S3-WROOM-1-N8R2. Xtensa LX7 dual-core, Wi-Fi b/g/n + Bluetooth LE 5, 8 MB flash, 2 MB quad-SPI PSRAM, PCB antenna. Pin map from datasheet v1.8 Table 3-1. IO35/36/37 are free on the -N8R2 (quad PSRAM) variant only.
U4 = SIH26113_Maternity_Assist_Belt:TMP117: TI TMP117AIDRVR high-accuracy digital temperature sensor, WSON-6 (DRV). +/-0.1 C, 1.8-5.5 V, I2C. Pin map from TMP117 SNOSD82D Table 5-1 (WSON column).
U5 = SIH26113_Maternity_Assist_Belt:LSM6DSOX: ST LSM6DSOXTR 6-axis IMU (3-axis accel + 3-axis gyro), LGA-14L. Pin map from LSM6DSOX DS12814 Rev.4 Table 1.
U6 = SIH26113_Maternity_Assist_Belt:AS5600: ams-OSRAM AS5600-ASOM 12-bit contactless magnetic rotary position sensor, SOIC-8. Fixed I2C address 0x36. Pin map from AS5600 DS000365 v1-06 Figure 4.
U7 = SIH26113_Maternity_Assist_Belt:AD8232: Analog Devices AD8232ACPZ-R7 single-lead heart-rate monitor front end. Supply 2.0-3.5 V. Pin map from AD8232 Rev.A Table 3.
U8 = SIH26113_Maternity_Assist_Belt:HX711: Avia Semiconductor HX711 24-bit ADC for bridge sensors, SOP-16L. Pin map from the HX711 English datasheet Table 1.

## Net classes
0 default: width 0.2 mm, drill 0.3 mm, clearance 0.15 mm
1 power: width 0.5 mm, drill 0.4 mm, clearance 0.2 mm
2 motor: width 0.5 mm, drill 0.4 mm, clearance 0.2 mm
3 analog_ecg: width 0.2 mm, drill 0.3 mm, clearance 0.2 mm